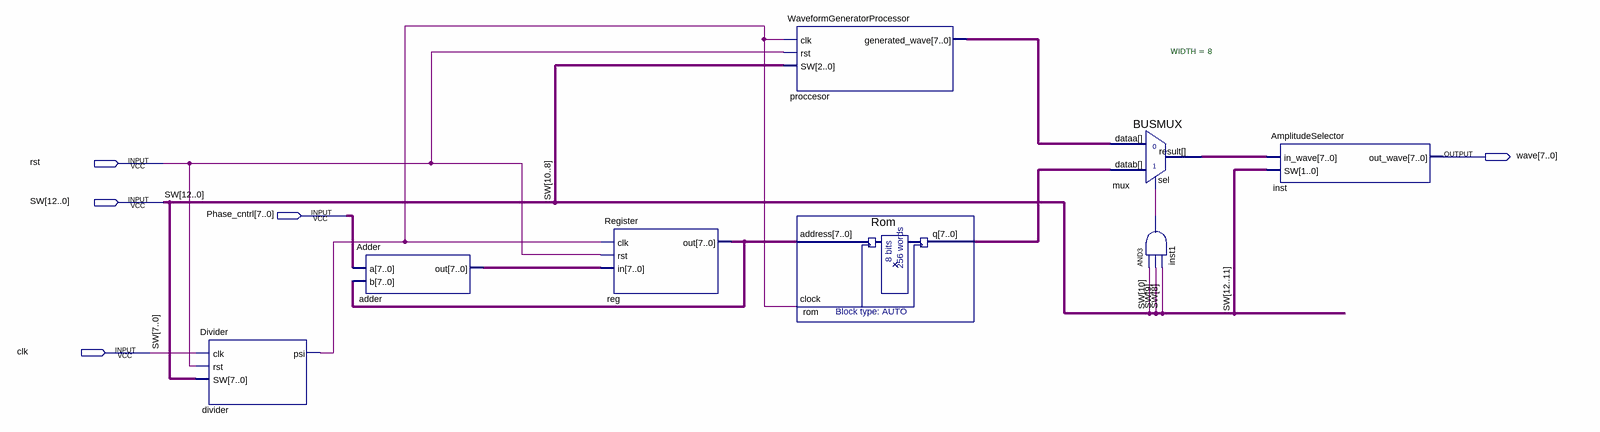
[diagram p0: schematic sheet]
// Quartus schematic WaveformGenerator.bdf as structural Verilog: 8 symbols, 5 pins
module WaveformGenerator (
  input  rst,
  input  [12:0] SW,
  input  [7:0] Phase_cntrl,
  input  clk,
  output [7:0] wave
);

  wire divider_psi, inst1_out;
  wire [7:0] adder_out, mux_result, proccesor_generated_wave, reg_out, rom_q;

  Divider divider (.clk(clk), .rst(rst), .SW(SW[7:0]), .psi(divider_psi));
  Adder adder (.a(Phase_cntrl), .b(reg_out), .out(adder_out));
  Register \reg  (.clk(divider_psi), .rst(rst), .in(adder_out), .out(reg_out));
  WaveformGeneratorProcessor proccesor (
    .clk(divider_psi), .rst(rst), .SW(SW[10:8]), .generated_wave(proccesor_generated_wave));
  Rom rom (.address(reg_out), .clock(divider_psi), .q(rom_q));
  BUSMUX #(.WIDTH(8)) mux (.datab(rom_q), .sel(inst1_out), .dataa(proccesor_generated_wave), .result(mux_result));
  and inst1 (inst1_out, SW[10], SW[9], SW[8]);
  AmplitudeSelector inst (.in_wave(mux_result), .SW(SW[12:11]), .out_wave(wave));
endmodule
